# EasyEDA Pro project EasyEDA_ProProject_HFS-P3_schematic_2024-08-10.epro

# Schematic HFS-P3_rev_eng
Create Date: 2024-06-17; Page Name: Sheet_1; Project Name: HFS-P3_scheamtic; Schematic Name: HFS-P3_rev_eng; Update Date: 2024-08-10; Add into BOM: yes; Company: Your Company; Convert to PCB: yes; Date: 2024-06-16; Draw By: nohatah; REV: 1.0; Sheet: 1/1
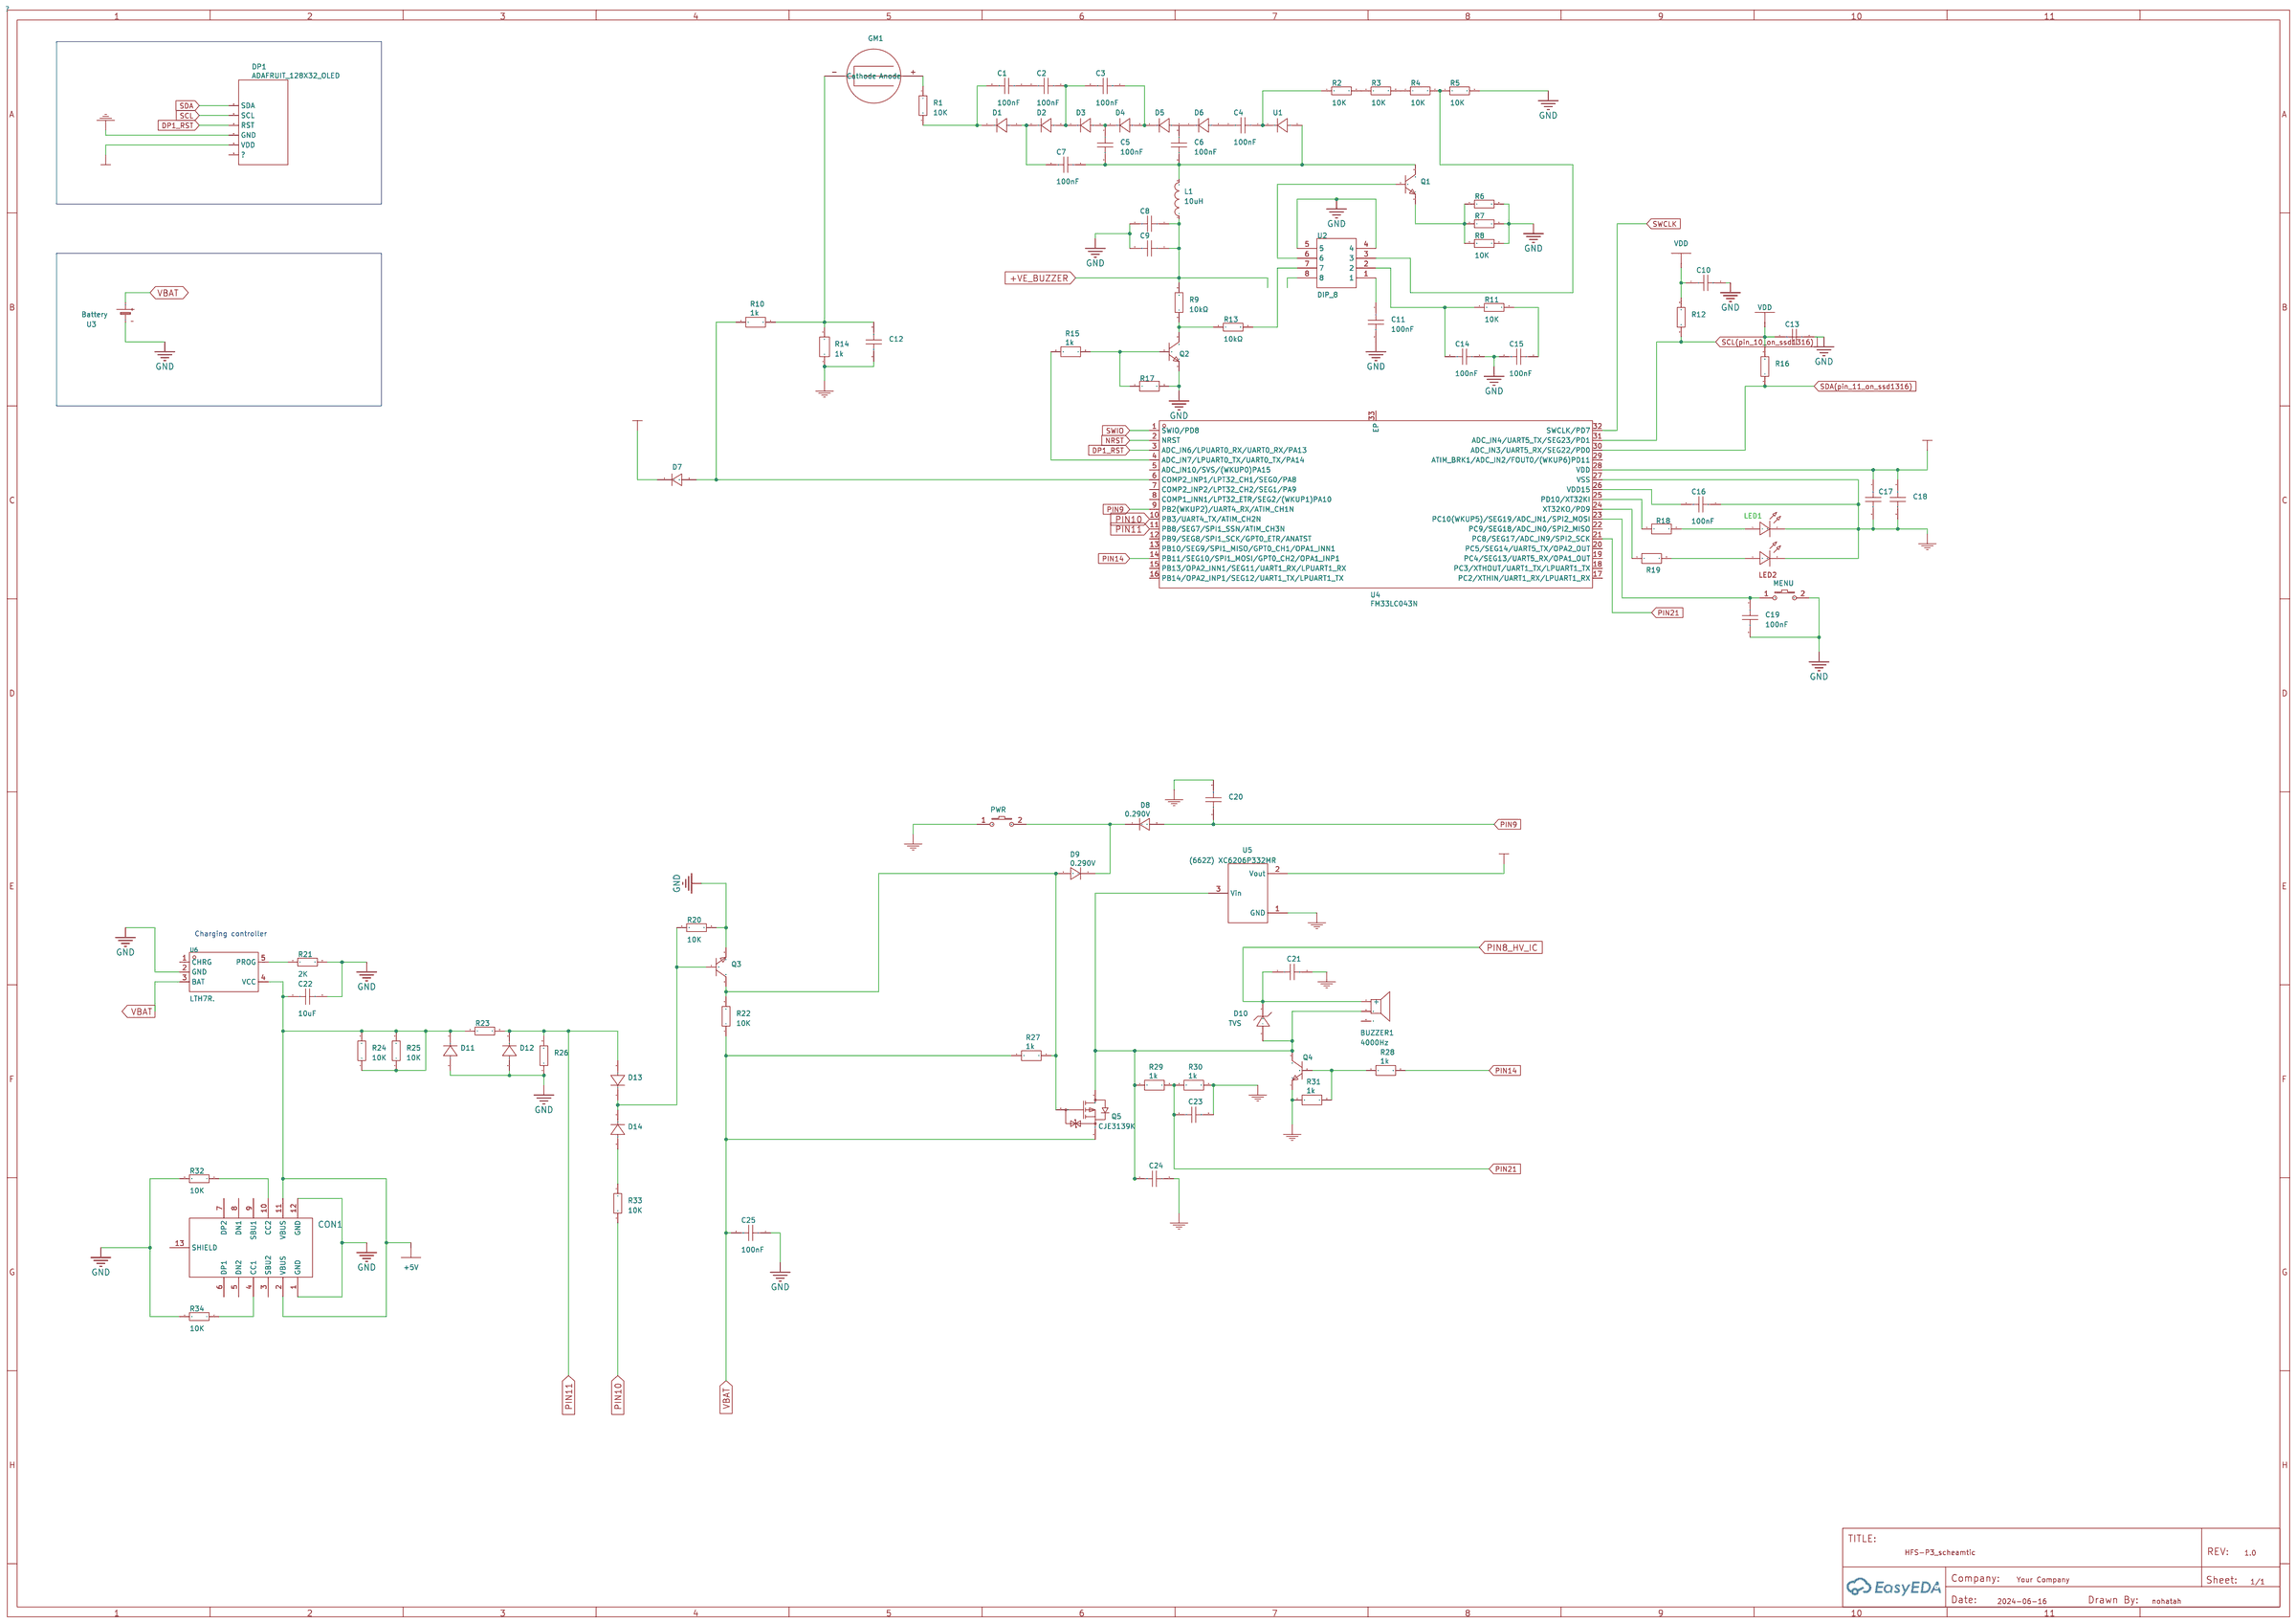
[diagram p0: schematic sheet]

## Parts
BUZZER1  4000Hz
C1  100nF  [C0201]
C2  100nF  [C0201]
C3  100nF  [C0201]
C4  100nF  [C0201]
C5  100nF  [C0201]
C6  100nF  [C0201]
C7  100nF  [C0201]
C8  100nF  [C0201]
C9  100nF  [C0201]
C10  100nF  [C0201]
C11  100nF  [C0201]
C12  0.1u
C13  100nF  [C0201]
C14  100nF  [C0201]
C15  100nF  [C0201]
C16  100nF  [C0603]
C17  100nF  [C0201]
C18  100nF  [C0201]
C19  100nF  [C0201]
C20  0.1u
C21  0.1u
C22  10uF  [C0201]
C23  0.1u
C24  0.1u
C25  100nF  [C0201]
CON1  -  [CON_USBC_GCT_USB4105]
D1  -  [DO-41_BD2.4-L4.7-P8.70-D0.9-RD]
D2  -  [DO-41_BD2.4-L4.7-P8.70-D0.9-RD]
D3  -  [DO-41_BD2.4-L4.7-P8.70-D0.9-RD]
D4  -  [DO-41_BD2.4-L4.7-P8.70-D0.9-RD]
D5  -  [DO-41_BD2.4-L4.7-P8.70-D0.9-RD]
D6  -  [DO-41_BD2.4-L4.7-P8.70-D0.9-RD]
D7  1N4007
D8  0.290V
D9  0.290V
D10  TVS  [SOD-323HE_L2.0-W1.4-LS2.5-RD]
D11  -  [DO-41_BD2.4-L4.7-P8.70-D0.9-RD]
D12  -  [DO-41_BD2.4-L4.7-P8.70-D0.9-RD]
D13  -  [DO-41_BD2.4-L4.7-P8.70-D0.9-RD]
D14  -  [DO-41_BD2.4-L4.7-P8.70-D0.9-RD]
DP1  ADAFRUIT_128X32_OLED
GM1  Geiger-Muller Tube
KEY1  MENU
KEY2  PWR
L1  10uH  [L0402]
LED1  LED-0603_R
LED2  LED-0603_R
Q1  -  [SOT-23_L2.9-W1.3-P1.90-LS2.4-BR]
Q2  2N3904(SOT-23)
Q3  -  [SOT-23_L2.9-W1.3-P1.90-LS2.4-BR]
Q4  2N3904(SOT-23)
Q5  CJE3139K
R1  10K  [R0201]
R2  10K  [R0201]
R3  10K  [R0201]
R4  10K  [R0201]
R5  10K  [R0201]
R6  10K  [R0201]
R7  10K  [R0201]
R8  10K  [R0201]
R9  10kΩ  [RES-TH_BD1.8-L3.2-P7.20-D0.4]
R10  1k
R11  10K  [R0201]
R12  10K  [R0201]
R13  10kΩ  [RES-TH_BD1.8-L3.2-P7.20-D0.4]
R14  1k
R15  1k
R16  10K  [R0201]
R17  1k
R18  1k
R19  1k
R20  10K  [R0201]
R21  2K  [R0201]
R22  10K  [R0201]
R23  10K  [R0201]
R24  10K  [R0201]
R25  10K  [R0201]
R26  10K  [R0201]
R27  1k
R28  1k
R29  1k
R30  1k
R31  1k
R32  10K  [R0201]
R33  10K  [R0201]
R34  10K  [R0201]
U1  -  [DO-41_BD2.4-L4.7-P8.70-D0.9-RD]
U2  DIP_8
U3  Battery
U4  FM33LC043N
U5  (662Z) XC6206P332MR
U6  LTH7R.  [SOT-23-5_L3.0-W1.7-P0.95-LS2.8-BL]

## Library data of the parts
BUZZER1 = 4000Hz: Supplier: LCSC; Supplier Part: C391029; Manufacturer: FUET(福声科技); Manufacturer Part: FUET-5020; JLCPCB Part Class: Extended Part
C1-C11 C13-C15 C17-C19 C22 C25 = CAP_0201: Supplier Footprint: 0201
C12 C20 C21 C23 C24 = 0.1u
C16 = CAP_0603: Supplier Footprint: 0603
CON1 = CON_USBC_GCT_USB4105
D1-D6 D11-D14 U1 = 1N4007: Supplier Footprint: DO-41
D7 = 1N4007: Supplier: LCSC; Manufacturer: SEMTECH; Supplier Part: C106903
D8 D9 = 0.290V: Supplier: LCSC; Supplier Part: C328592; Manufacturer: BLUE ROCKET; Manufacturer Part: 1N4007W
D10 = TVS: Supplier: LCSC
DP1 = ADAFRUIT_128X32_OLED
GM1 = Geiger-Muller Tube: Manufacturer Part: SBM-20; link: https://www.gstube.com/data/2398/
KEY1 KEY2 = PWR: Supplier Part: C118141; Supplier: LCSC; Manufacturer Part: K2-1107ST-A4SW-06; 制造商: 韩国韩荣
L1 = L_0402
LED1 LED2 = LED-0603_R: Manufacturer: EVERLIGHT(台湾亿光); Manufacturer Part: 19-217/R6C-AL1M2VY/3T; Supplier Part: C72044; Supplier: LCSC
Q1 Q3 = S8050_NPN: Supplier Footprint: SOT-23
Q2 Q4 = 2N3904(SOT-23): Supplier: LCSC; Manufacturer: KEC; Manufacturer Part: 2n3904S-RTK/PS; Supplier Part: C18536; Paste Type: SOT-23
Q5 = CJE3139K: Supplier: LCSC; Manufacturer: CJ(江苏长电/长晶); Supplier Part: C70991; JLCPCB Part Class: Extended Part
R1-R8 R11 R12 R16 R20-R26 R32-R34 = Res_0201: Supplier Footprint: 0201
R9 R13 = Res_AXIAL-1/8W: Supplier Footprint: Through
R10 R14 R15 R17-R19 R27-R31 = 1k
U2 = DIP_8: Manufacturer: None; Manufacturer Part: Dip 8; Supplier: None; Supplier Part: None; link: None
U3 = BATTERY
U4 = FM33LC043N: Supplier: LCSC; Supplier Part: C908397; Manufacturer: FM(复旦微); JLCPCB Part Class: Extended Part
U5 = (662Z) XC6206P332MR: Supplier: LCSC; Manufacturer: TOREX(特瑞仕); Manufacturer Part: XC6206P332MR-G; Supplier Part: C5446; JLCPCB Part Class: Basic Part
U6 = LTH7R.: LCSC Part Name: 4054 停产; Supplier Part: C841234; Manufacturer: FM(富满); Supplier Footprint: SOT-23-5; JLCPCB Part Class: Extended Part; Datasheet: https://atta.szlcsc.com/upload/public/pdf/source/20200922/C841234_2998D767742943B7ECDC46964238CD02.pdf; Supplier: LCSC

## Nets
+5V: C22.1 CON1.2(VBUS) CON1.11(VBUS) D11.1(K) R23.1 R24.1 R24.2 R25.1 R25.2 U6.4(VCC)
GND: C8.2 C9.2 C10.2 C11.2 C12.1 C13.2 C14.1 C15.2 C16.1 C17.2 C18.2 C19.2 C20.2 C21.2 C22.2 C23.2 C24.2 C25.1 C25.2 CON1.1(GND) CON1.12(GND) D11.2(A) D12.2(A) DP1.P$4(GND) KEY1.2 KEY2.1 LED1.2 LED2.2 Q2.1(E) Q3.2(E) Q4.1(E) Q5.2(S) R5.2 R6.2 R7.2 R8.1 R14.1 R17.2 R20.2 R21.2 R22.1 R26.1 R27.1 R30.2 R31.1 R32.2 R34.2 U2.4 U2.5 U3.(+) U4.27(VSS) U5.1(GND) U6.2(GND) U6.3(BAT)
VDD: C10.1 C13.1 C17.1 C18.1 D7.1 DP1.P$5(VDD) R12.2 R16.2 U4.28(VDD) U5.2(Vout)
+VE_BUZZER: C8.1 C9.1 L1.1 R9.2
DP1_RST: DP1.P$3(RST) U4.3(ADC_IN6/LPUART0_RX/UART0_RX/PA13)
NRST: U4.2(NRST)
PIN8_HV_IC: BUZZER1.1(+) C21.1 D10.1(C)
PIN9: C20.1 D8.2 U4.9(PB2(WKUP2)/UART4_RX/ATIM_CH1N)
PIN10: R33.2 U4.10(PB3/UART4_TX/ATIM_CH2N)
PIN11: D12.1(K) D13.2(A) R23.2 R26.2 U4.11(PB8/SEG7/SPI1_SSN/ATIM_CH3N)
PIN14: R28.2 U4.14(PB11/SEG10/SPI1_MOSI/GPT0_CH2/OPA1_INP1)
PIN21: C23.1 R29.2 R30.1 U4.21(PC8/SEG17/ADC_IN9/SPI2_SCK)
SCL: DP1.P$2(SCL)
SCL(pin_10_on_ssd1316): R12.1 U4.31(ADC_IN4/UART5_TX/SEG23/PD1)
SDA: DP1.P$1(SDA)
SDA(pin_11_on_ssd1316): R16.1 U4.30(ADC_IN3/UART5_RX/SEG22/PD0)
SWCLK: U4.32(SWCLK/PD7)
SWIO: U4.1(SWIO/PD8)
Net-(BUZZER1-2): BUZZER1.2 C24.1 D10.2(A) Q4.3(C) Q5.3(D) R29.1 U5.3(Vin)
Net-(C1-1): C1.1 C2.2
Net-(C1-2): C1.2 D1.1(K) R1.2
Net-(C2-1): C2.1 C3.2 D2.2(A) D3.1(K)
Net-(C3-1): C3.1 D4.2(A) D5.1(K)
Net-(C4-1): C4.1 R2.1 U1.1(K)
Net-(C4-2): C4.2 D6.2(A)
Net-(C5-1): C5.1 D3.2(A) D4.1(K)
Net-(C5-2): C5.2 C6.2 C7.1 L1.2 Q1.3(C) U1.2(A)
Net-(C7-2): C7.2 D1.2(A) D2.1(K)
Net-(C11-1): C11.1 U2.1
Net-(C12-2): C12.2 GM1.-(Cathode) R10.2 R14.2
Net-(C14-2): C14.2 R11.1 U2.2
Net-(C15-1): C15.1 R11.2
Net-(C16-2): C16.2 U4.26(VDD15)
Net-(C19-1): C19.1 KEY1.1 U4.23(PC10(WKUP5)/SEG19/ADC_IN1/SPI2_MOSI)
Net-(CON1-4): CON1.4(CC1) R34.1
Net-(CON1-10): CON1.10(CC2) R32.1
Net-(D5-2): D5.2(A) D6.1(K)
Net-(D7-2): D7.2 R10.1 U4.6(COMP2_INP1/LPT32_CH1/SEG0/PA8)
Net-(D8-1): D8.1 D9.1 KEY2.2
Net-(D9-2): D9.2 Q3.3(C) Q5.1(G) R22.2 R27.2
Net-(D13-1): D13.1(K) D14.1(K) Q3.1(B) R20.1
Net-(D14-2): D14.2(A) R33.1
Net-(GM1-+): GM1.+(Anode) R1.1
Net-(LED1-1): LED1.1 R18.2
Net-(LED2-1): LED2.1 R19.2
Net-(Q1-1): Q1.1(B) U2.6
Net-(Q1-2): Q1.2(E) R6.1 R7.1 R8.2
Net-(Q2-2): Q2.2(B) R15.2 R17.1
Net-(Q2-3): Q2.3(C) R9.1 R13.1
Net-(Q4-2): Q4.2(B) R28.1 R31.2
Net-(R2-2): R2.2 R3.1
Net-(R3-2): R3.2 R4.1
Net-(R4-2): R4.2 R5.1 U2.3
Net-(R13-2): R13.2 U2.7
Net-(R15-1): R15.1 U4.4(ADC_IN7/LPUART0_TX/UART0_TX/PA14)
Net-(R18-1): R18.1 U4.25(PD10/XT32KI)
Net-(R19-1): R19.1 U4.24(XT32KO/PD9)
Net-(R21-1): R21.1 U6.5(PROG)

Not connected (* = marked no-connect by the designer): BUZZER1 3; C6 1; CON1 3(SBU2) 5(DN2) 6(DP1) 7(DP2) 8(DN1) 9(SBU1) 13(SHIELD); DP1 P$6(?); U2 8; U4 5(ADC_IN10/SVS/(WKUP0)PA15) 7(COMP2_INP2/LPT32_CH2/SEG1/PA9) 8(COMP1_INN1/LPT32_ETR/SEG2/(WKUP1)PA10) 12(PB9/SEG8/SPI1_SCK/GPT0_ETR/ANATST) 13(PB10/SEG9/SPI1_MISO/GPT0_CH1/OPA1_INN1) 15(PB13/OPA2_INN1/SEG11/UART1_RX/LPUART1_RX) 16(PB14/OPA2_INP1/SEG12/UART1_TX/LPUART1_TX) 17(PC2/XTHIN/UART1_RX/LPUART1_RX) 18(PC3/XTHOUT/UART1_TX/LPUART1_TX) 19(PC4/SEG13/UART5_RX/OPA1_OUT) 20(PC5/SEG14/UART5_TX/OPA2_OUT) 22(PC9/SEG18/ADC_IN0/SPI2_MISO) 29(ATIM_BRK1/ADC_IN2/FOUT0/(WKUP6)PD11) 33(EP); U6 1(CHRG)

## Notes on the sheet
- Charging controller
